# Altium schematic sheet mosfet.SchDoc
size A4; SheetNumber: 3; SheetTotal: 3
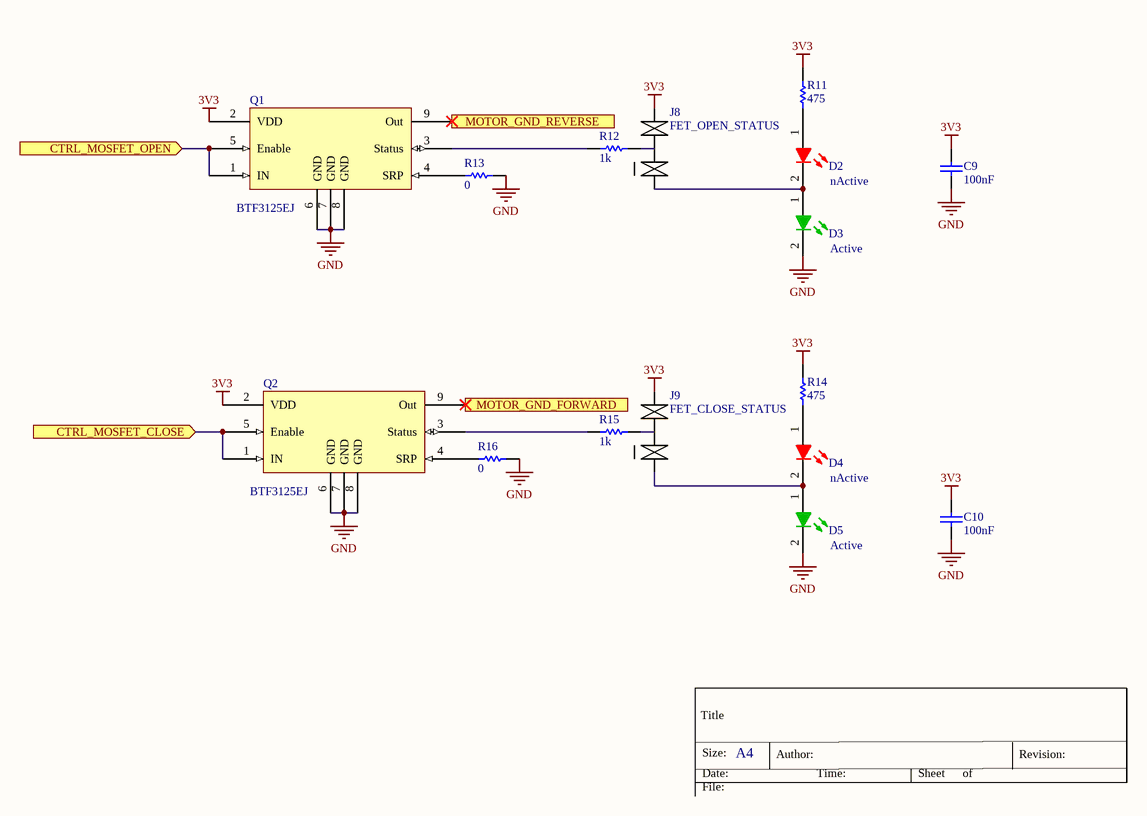
[diagram p0: mosfet.SchDoc]

## Parts
C9  100nF  [CAP0603]
C10  100nF  [CAP0603]
D2  nActive  [0603 LED Red]
D3  Active  [0603 LED Green]
D4  nActive  [0603 LED Red]
D5  Active  [0603 LED Green]
J8  FET_OPEN_STATUS  [Jumper Dual]
J9  FET_CLOSE_STATUS  [Jumper Dual]
Q1  BTF3125EJ  [BTF3xxxEJ]
Q2  BTF3125EJ  [BTF3xxxEJ]
R11  475  [RES0603]
R12  1k  [RES0603]
R13  0  [RES0603]
R14  475  [RES0603]
R15  1k  [RES0603]
R16  0  [RES0603]

## Ports
CTRL_MOSFET_CLOSE (in), CTRL_MOSFET_OPEN (in), MOTOR_GND_FORWARD (in), MOTOR_GND_REVERSE (in)

## Nets
3V3: C9.2 C10.2 J8.2(B) J9.2(B) Q1.2(VDD) Q2.2(VDD) R11.2 R14.2
GND: C9.1 C10.1 D3.2(K) D5.2(K) Q1.6(GND) Q1.7(GND) Q1.8(GND) Q2.6(GND) Q2.7(GND) Q2.8(GND) R13.2 R16.2
CTRL_MOSFET_CLOSE: Q2.1(IN) Q2.5(Enable) ; port CTRL_MOSFET_CLOSE
CTRL_MOSFET_OPEN: Q1.1(IN) Q1.5(Enable) ; port CTRL_MOSFET_OPEN
MOTOR_GND_FORWARD: Q2.9(Out) ; port MOTOR_GND_FORWARD
MOTOR_GND_REVERSE: Q1.9(Out) ; port MOTOR_GND_REVERSE
NetD2_1: D2.1(A) R11.1
NetD2_2: D2.2(K) D3.1(A) J8.1(A)
NetD4_1: D4.1(A) R14.1
NetD4_2: D4.2(K) D5.1(A) J9.1(A)
NetJ8_3: J8.3(C) R12.2
NetJ9_3: J9.3(C) R15.2
NetQ1_3: Q1.3(Status) R12.1
NetQ1_4: Q1.4(SRP) R13.1
NetQ2_3: Q2.3(Status) R15.1
NetQ2_4: Q2.4(SRP) R16.1

## Notes on the sheet
- Title
- Size:
- Date:
- A4
- Author:
- Time:
- Sheet
- of
- Revision:
- File:

## Library data of the parts
C9 C10 = Capacitor 0603: Chip Capacitor 0603, Body 1.6x0.8mm, IPC Medium Density; Value: 100nF
D2 D4 = LED Red 0603: LED, SMT, 0603(1608), 1.1mm thickness, Red
D3 D5 = LED Green 0603: LED, SMT, 0603(1608), 1.1mm thickness, Green
J8 J9 = Jumper Dual
Q1 Q2 = BTF3125EJ: BTF3125EJ is a 125 mΩ single channel Smart Low-Side Power Switch
R11-R16 = Resistor 0603: Chip Resistor 0603, Body 1.6x0.8mm, IPC Medium Density
  R11 R14: Value: 475
  R12 R15: Value: 1k
  R13 R16: Value: 0